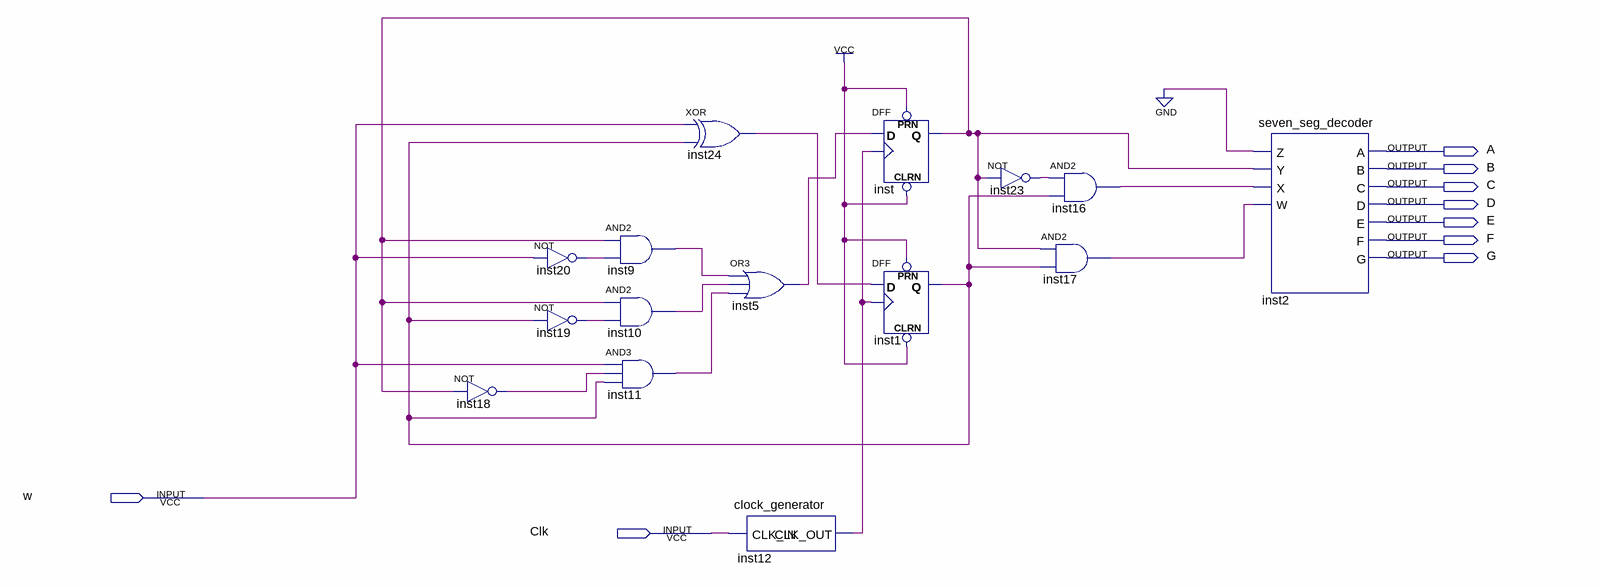
[diagram p0: schematic sheet]
// Quartus schematic lab11step2.bdf as structural Verilog: 15 symbols, 9 pins
module lab11step2 (
  input  w,
  input  Clk,
  output A,
  output B,
  output C,
  output D,
  output E,
  output F,
  output G
);

  wire inst1_q, inst5_out, inst9_out, inst10_out, inst11_out, inst12_clk_out, inst16_out, inst17_out,
       inst18_out, inst19_out, inst20_out, inst23_out, inst24_out, inst_q;

  not inst18 (inst18_out, inst_q);
  not inst20 (inst20_out, w);
  not inst19 (inst19_out, inst1_q);
  and inst9 (inst9_out, inst_q, inst20_out);
  and inst10 (inst10_out, inst_q, inst19_out);
  and inst11 (inst11_out, w, inst18_out, inst1_q);
  xor inst24 (inst24_out, w, inst1_q);
  or inst5 (inst5_out, inst9_out, inst10_out, inst11_out);
  clock_generator inst12 (.CLK_IN(Clk), .CLK_OUT(inst12_clk_out));
  DFF inst (.CLRN(1'b1), .CLK(inst12_clk_out), .D(inst5_out), .PRN(1'b1), .Q(inst_q));
  DFF inst1 (.CLRN(1'b1), .CLK(inst12_clk_out), .D(inst24_out), .PRN(1'b1), .Q(inst1_q));
  not inst23 (inst23_out, inst_q);
  and inst16 (inst16_out, inst23_out, inst1_q);
  and inst17 (inst17_out, inst_q, inst1_q);
  seven_seg_decoder inst2 (
    .Z(1'b0), .Y(inst_q), .X(inst16_out), .W(inst17_out), .A(A), .B(B), .C(C), .D(D), .E(E), .F(F), .G(G));
endmodule
